# EAGLE design OOBD-Cup_v5 (EAGLE 5.11)
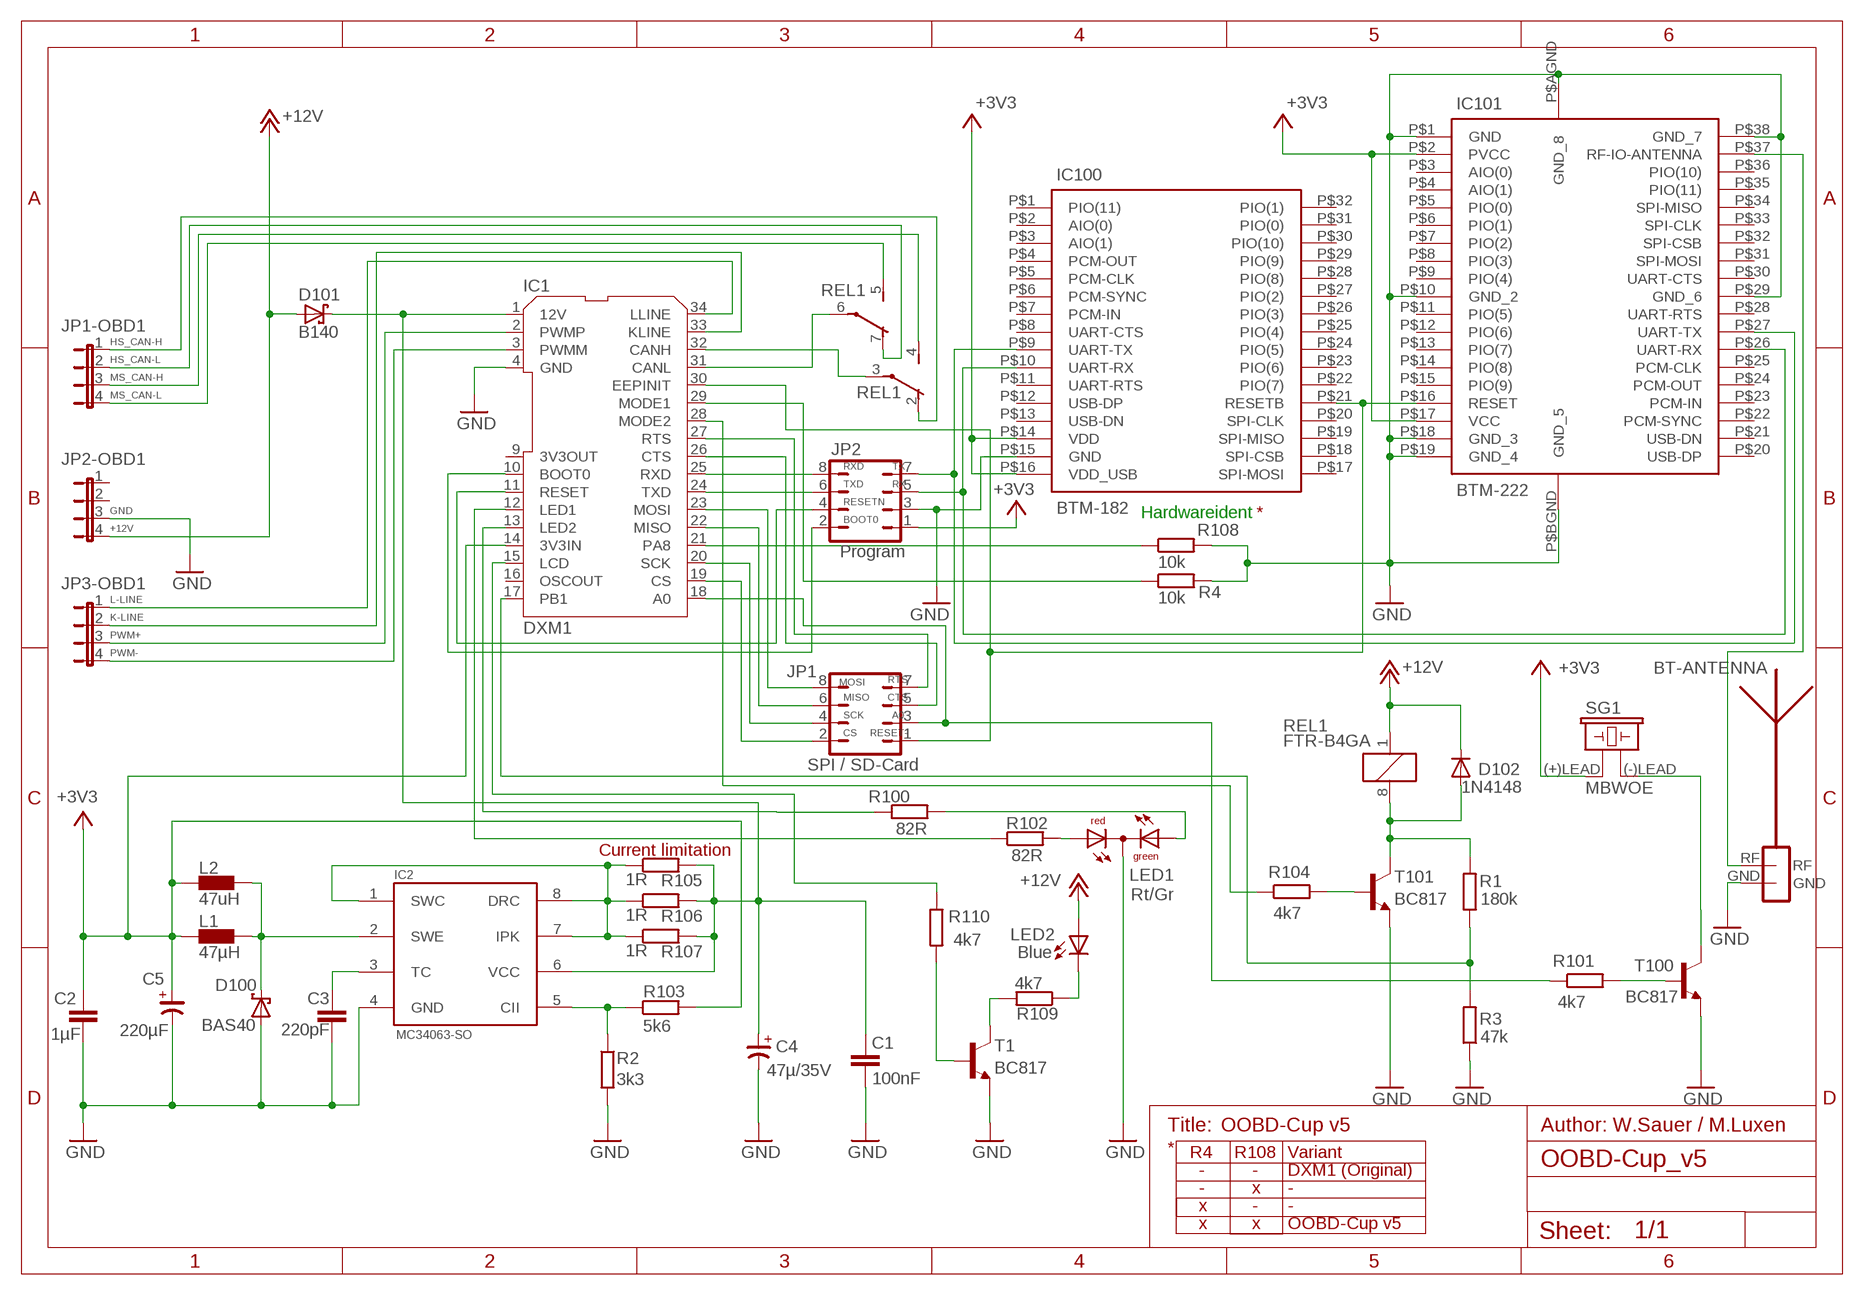
[diagram p0: schematic, sheet 1]

## Parts
BT-ANTENNA  ANTENNA_1RIGHT  [SWRA117D_RIGHT]
C1  100nF  C-EUC0603K  [C0603K]
C2  1µF  C-EUC0603K  [C0603K]
C3  220pF  C-EUC0603K  [C0603K]
C4  47µ/35V  CP-SV-D  [SV-D]
C5  220µF  CP_6032-TE-C  [C6032-TE-C]
D100  BAS40  [SOT23]
D101  B140  SCHOTTKY-DIODESMD  [SMB]
D102  1N4148  DIODE-MINIMELF  [MINIMELF]
IC1  DXM1  DXM1-MINI  [DMX1-MINI]
IC2  MC34063-SO  [SO8]
IC100  BTM-182  [BTM-182]
IC101  BTM-222  [BTM-222]
JP1  SPI / SD-Card  JP4Q  [JP4Q]
JP1-OBD1  JP4E  [JP4]
JP2  Program  JP4Q  [JP4Q]
JP2-OBD1  JP4E  [JP4]
JP3-OBD1  JP4E  [JP4]
L1  47µH  07HCP-XXXX-50  [07HCP-XXXX-50]
L2  47uH  PIS2408  [PIS2408]
LED1  Rt/Gr  DUOLED2X5  [DUOLED2X5]
LED2  Blue  LEDSQR5.7X3.2  [U57X32]
R1  180k  R-EU_R0603  [R0603]
R2  3k3  R-EU_R0603  [R0603]
R3  47k  R-EU_R0603  [R0603]
R4  10k  R-EU_R0603  [R0603]
R100  82R  R-EU_R0603  [R0603]
R101  4k7  R-EU_R0603  [R0603]
R102  82R  R-EU_R0603  [R0603]
R103  5k6  R-EU_R0603  [R0603]
R104  4k7  R-EU_R0603  [R0603]
R105  1R  R-EU_R0805  [R0805]
R106  1R  R-EU_R0805  [R0805]
R107  1R  R-EU_R0805  [R0805]
R108  10k  R-EU_R0603  [R0603]
R109  4k7  R-EU_R0603  [R0603]
R110  4k7  R-EU_R0603  [R0603]
REL1  FTR-B4GA  [FTR-B4GA]
SG1  MBWOE  [BME0603SA]
T1  BC817  BC847  [SOT23]
T100  BC817  BC847  [SOT23]
T101  BC817  BC847  [SOT23]

## Nets
12V_DOUT: C1.1 C4.+ D101.C IC1.1(12V) IC2.6(VCC) R105.2 R106.2 R107.2
+3V3: C2.1 C5.+ IC1.14(3V3IN) IC100.P$14(VDD) IC100.P$16(VDD_USB) IC101.P$2(PVCC) IC101.P$17(VCC) JP2.1 L1.1 L2.P$1 R103.2 SG1.(+)LEAD
+12V: D101.A D102.C JP2-OBD1.4 LED2.A REL1.1
A0: IC1.18(A0) JP1.3 R101.1
BOOT0: IC1.10(BOOT0) JP2.2
CS: IC1.19(CS) JP1.2
CTS: IC1.26(CTS) JP1.5
GND: BT-ANTENNA.GND C1.2 C2.2 C3.2 C4.- C5.- D100.1(A) IC1.4(GND) IC2.4(GND) IC100.P$15(GND) IC101.P$1(GND) IC101.P$10(GND_2) IC101.P$18(GND_3) IC101.P$19(GND_4) IC101.P$29(GND_6) IC101.P$38(GND_7) IC101.P$AGND(GND_8) IC101.P$BGND(GND_5) JP2-OBD1.3 JP2.3 LED1.K(C) R2.2 R3.1 R4.2 R108.2 T1.2(E) T100.2(E) T101.2(E)
HS_CAN-H: JP1-OBD1.1 REL1.2(O)
HS_CAN-L: JP1-OBD1.2 REL1.7(O)
K-LINE: IC1.33(KLINE) JP3-OBD1.2
L-LINE: IC1.34(LLINE) JP3-OBD1.1
LED1: IC1.12(LED1) R102.1
LED2: IC1.13(LED2) R100.1
MISO: IC1.22(MISO) JP1.6
MODE1: IC1.29(MODE1) R4.1
MODE2: IC1.28(MODE2) R104.1
MOSI: IC1.23(MOSI) JP1.8
MS_CAN-H: JP1-OBD1.3 REL1.4(S)
MS_CAN-L: JP1-OBD1.4 REL1.5(S)
N$1: IC2.5(CII) R2.1 R103.1
N$2: C3.1 IC2.3(TC)
N$3: IC1.21(PA8) R108.1
N$4: LED1.AR R102.2
N$5: IC2.1(SWC) IC2.7(IPK) IC2.8(DRC) R105.1 R106.1 R107.1
N$6: LED1.AG R100.2
N$7: LED2.K(C) R109.1
N$8: IC1.15(LCD) R110.1
N$9: R110.2 T1.1(B)
N$10: R109.2 T1.3(C)
N$19: IC1.17(PB1) R1.1 R3.2
N$20: R104.2 T101.1(B)
N$21: IC1.32(CANH) REL1.3(P)
N$22: IC1.31(CANL) REL1.6(P)
N$23: SG1.(-)LEAD T100.3(C)
N$24: R101.2 T100.1(B)
N$27: D102.A R1.2 REL1.8 T101.3(C)
N$29: D100.3(C) IC2.2(SWE) L1.2 L2.P$2
PWM+: IC1.2(PWMP) JP3-OBD1.3
PWM-: IC1.3(PWMM) JP3-OBD1.4
RESET-: IC1.30(EEPINIT) IC100.P$21(RESETB) IC101.P$16(RESET) JP1.1
RESETN: IC1.11(RESET) JP2.4
RF: BT-ANTENNA.RF IC101.P$37(RF-IO-ANTENNA)
RTS: IC1.27(RTS) JP1.7
RX: IC100.P$10(UART-RX) IC101.P$26(UART-RX) JP2.5
RXD: IC1.25(RXD) JP2.8
SCK: IC1.20(SCK) JP1.4
TX: IC100.P$9(UART-TX) IC101.P$27(UART-TX) JP2.7
TXD: IC1.24(TXD) JP2.6
Unconnected: IC1.16(OSCOUT) IC100.P$1(PIO(11)) IC100.P$2(AIO(0)) IC100.P$3(AIO(1)) IC100.P$4(PCM-OUT) IC100.P$5(PCM-CLK) IC100.P$6(PCM-SYNC) IC100.P$7(PCM-IN) IC100.P$8(UART-CTS) IC100.P$11(UART-RTS) IC100.P$12(USB-DP) IC100.P$13(USB-DN) IC100.P$17(SPI-MOSI) IC100.P$18(SPI-CSB) IC100.P$19(SPI-MISO) IC100.P$20(SPI-CLK) IC100.P$22(PIO(7)) IC100.P$23(PIO(6)) IC100.P$24(PIO(5)) IC100.P$25(PIO(4)) IC100.P$26(PIO(3)) IC100.P$27(PIO(2)) IC100.P$28(PIO(8)) IC100.P$29(PIO(9)) IC100.P$30(PIO(10)) IC100.P$31(PIO(0)) IC100.P$32(PIO(1)) IC101.P$3(AIO(0)) IC101.P$4(AIO(1)) IC101.P$5(PIO(0)) IC101.P$6(PIO(1)) IC101.P$7(PIO(2)) IC101.P$8(PIO(3)) IC101.P$9(PIO(4)) IC101.P$11(PIO(5)) IC101.P$12(PIO(6)) IC101.P$13(PIO(7)) IC101.P$14(PIO(8)) IC101.P$15(PIO(9)) IC101.P$20(USB-DP) IC101.P$21(USB-DN) IC101.P$22(PCM-SYNC) IC101.P$23(PCM-IN) IC101.P$24(PCM-OUT) IC101.P$25(PCM-CLK) IC101.P$28(UART-RTS) IC101.P$30(UART-CTS) IC101.P$31(SPI-MOSI) IC101.P$32(SPI-CSB) IC101.P$33(SPI-CLK) IC101.P$34(SPI-MISO) IC101.P$35(PIO(11)) IC101.P$36(PIO(10)) JP2-OBD1.1 JP2-OBD1.2

## Notes on the sheet
- Hardwareident | *
- Current limitation
- Title: | OOBD-Cup v5 | Author: W.Sauer / M.Luxen
- * | R4 | R108 | Variant
- - | - | DXM1 (Original)
- - | x | -
- x | - | -
- x | x | OOBD-Cup v5

## Power pins joined to a net without a drawn wire
3V3OUT: IC1.9(3V3OUT)

## Library data of the parts
BT-ANTENNA = ant-planar-1:ANTENNA_1
C1-C3 = rcl:C-EU: CAPACITOR, European symbol
C4 = cap-master:CP-: POLARIZED CAP
C5 = rc-master:CP_: POLARIZED CAP
D100 = diode:BAS40: Silicon Schottky Diodes General-purpose diode for high-speed switching
D101 = diode:SCHOTTKY-DIODE: Schottky Diode
D102 = diode:DIODE-: DIODE
IC1 = DXM:DXM1-MINI
IC2 = mc34063:MC34063-SO: DC/DC converter MC34063 in SO08.
IC100 = BTM182:BTM-182: Rayson BTM-182 Bluetooth Modul all Pins
IC101 = btm-222:BTM-222: Rayson BTM-222 Bluetooth Modul all Pins
JP1 JP2 = jumper:JP4Q: JUMPER
JP1-OBD1 JP2-OBD1 JP3-OBD1 = jumper:JP4E: JUMPER
L1 = Inductor-Fastron:07HCP-XXXX-50: Fastron 07HCP series (with tube) Plugable inductors (shielded) Source: http://www.fastrongroup.com
L2 = Inductor-Fastron:PIS2408: Fastron SMD Power Inductors Source: http://www.fastrongroup.com/series/47/findProducts
LED1 = led:DUOLED2X5: DUO LED 2 colors, 2.5 x 5 mm, recangle
LED2 = led:LED: LED OSRAM: - CHIPLED LG R971, LG N971, LY N971, LG Q971, LY Q971, LO R971, LY R971 LH N974, LH R974 LS Q976, LO Q976, LY Q976 LO Q996 - Hyper CHIPLED LW Q18S LB Q993, LB Q99A, LB R99A - SideLED LS A670, LO A670, LY A670, LG A670, LP A670 LB A673, LV A673, LT A673, LW A673 LH A674 LY A675 LS A676, LA A676, LO A676, LY A676, LW A676 LS A679, LY A679, LG A679 - Hyper Micro SIDELED® LS Y876, LA Y876, LO Y876, LY Y876 LT Y87S - SmartLED LW L88C, LW L88S LB L89C, LB L89S, LG L890 LS L89K, LO L89K, LY L89K LS L896, LA L896, LO L896, LY L896 - TOPLED LS T670, LO T670, LY T670, LG T670, LP T670 LSG T670, LSP T670, LSY T670, LOP T670, LYG T670 LG T671, LOG T671, LSG T671 LB T673, LV T673, LT T673, LW T673 LH T674 LS T676, LA T676, LO T676, LY T676, LB T676, LH T676, LSB T676, LW T676 LB T67C, LV T67C, LT T67C, LS T67K, LO T67K, LY T67K, LW E67C LS E67B, LA E67B, LO E67B, LY E67B, LB E67C, LV E67C, LT E67C LW T67C LS T679, LY T679, LG T679 LS T770, LO T770, LY T770, LG T770, LP T770 LB T773, LV T773, LT T773, LW T773 LH T774 LS E675, LA E675, LY E675, LS T675 LS T776, LA T776, LO T776, LY T776, LB T776 LHGB T686 LT T68C, LB T68C - Hyper Mini TOPLED® LB M676 - Mini TOPLED Santana® LG M470 LS M47K, LO M47K, LY M47K Source: http://www.osram.convergy.de LUXEON: - LUMILED® LXK2-PW12-R00, LXK2-PW12-S00, LXK2-PW14-U00, LXK2-PW14-V00 LXK2-PM12-R00, LXK2-PM12-S00, LXK2-PM14-U00 LXK2-PE12-Q00, LXK2-PE12-R00, LXK2-PE12-S00, LXK2-PE14-T00, LXK2-PE14-U00 LXK2-PB12-K00, LXK2-PB12-L00, LXK2-PB12-M00, LXK2-PB14-N00, LXK2-PB14-P00, LXK2-PB14-Q00 LXK2-PR12-L00, LXK2-PR12-M00, LXK2-PR14-Q00, LXK2-PR14-R00 LXK2-PD12-Q00, LXK2-PD12-R00, LXK2-PD12-S00 LXK2-PH12-R00, LXK2-PH12-S00 LXK2-PL12-P00, LXK2-PL12-Q00, LXK2-PL12-R00 Source: www.luxeon.com KINGBRIGHT: KA-3528ASYC Source: www.kingbright.com
R1-R4 R100-R110 = rcl:R-EU_: RESISTOR, European symbol
REL1 = relay:FTR-B4: Fujitsu FTR-B4 Series Ultra Miniature 2-Poles 2A (SLIM PROFILE SIGNAL RELAY); MN: Fujitsu; MPN: FTR-B4GAxxxZ; OC_REICHELT: FTR-B4GA 12V
SG1 = buzzer:MBWOE: Buzzer SMD Miniaturbuzzer; MF: Grewus
T1 T100 T101 = transistor:BC847: NPN TRANSISTOR

## Board
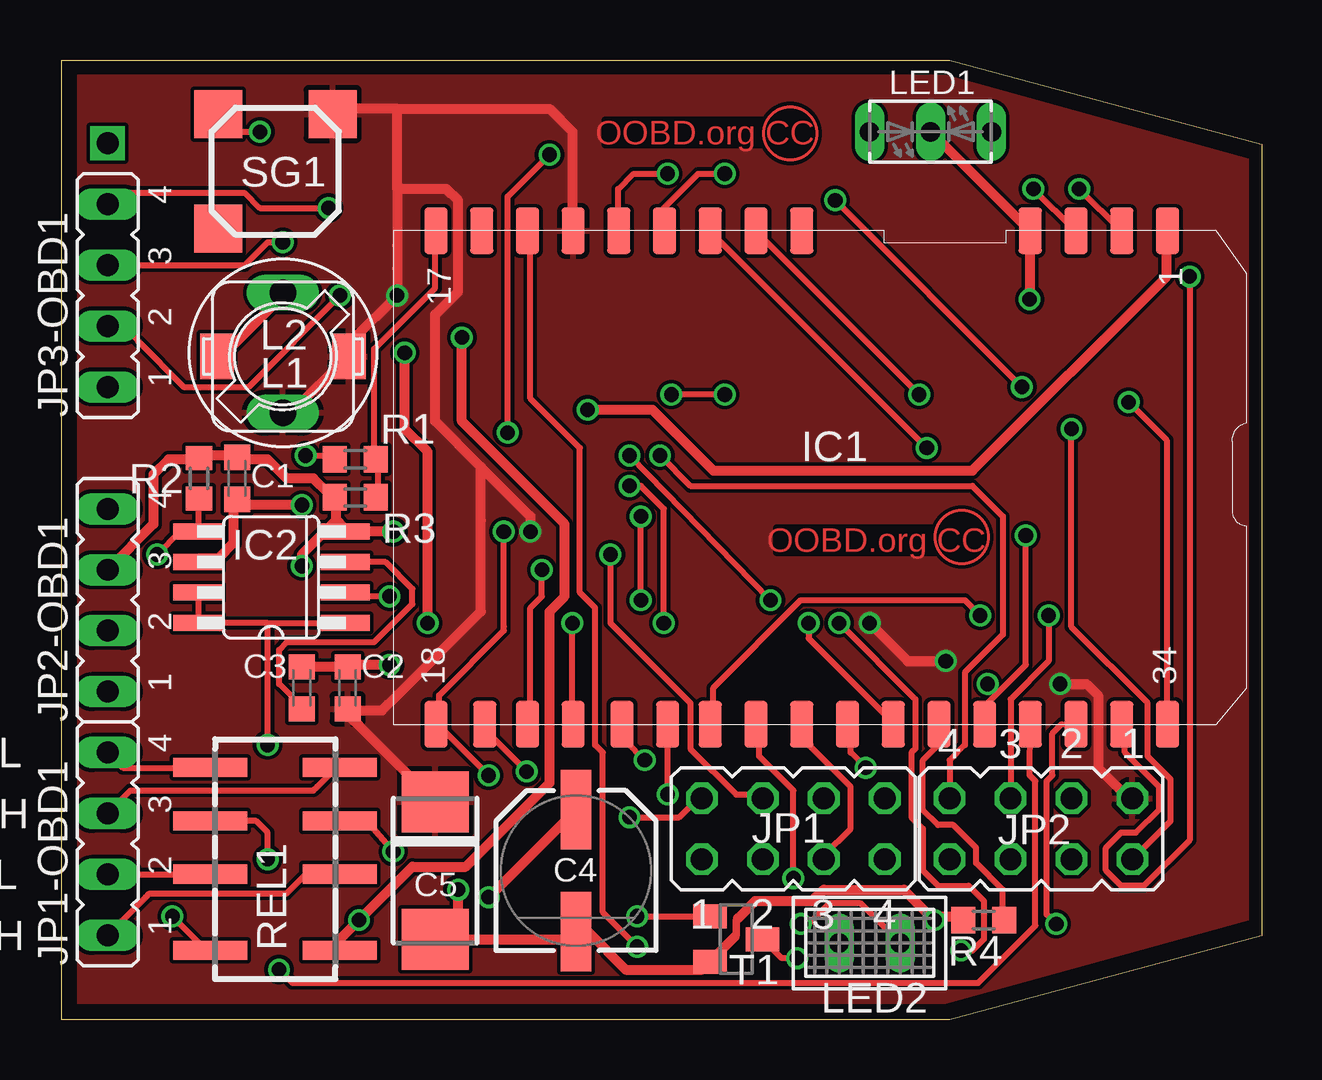
[diagram p1: board, top side]
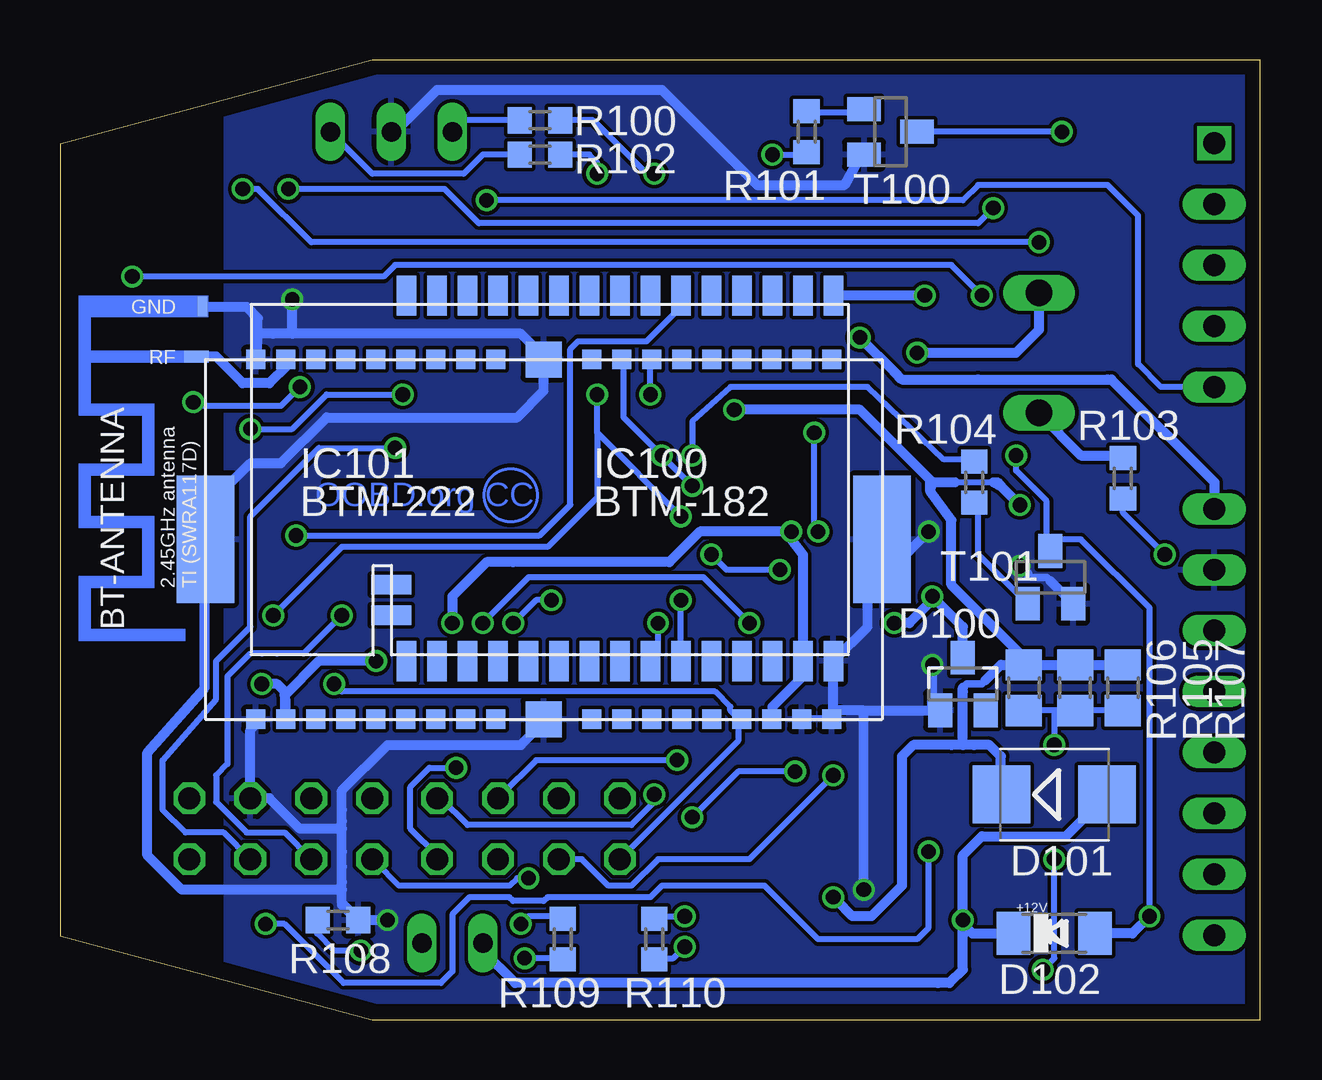
[diagram p2: board, bottom side, seen from below]

Size 50 x 40 mm. Coordinates in mm from the lower left corner, seen from the top.
Outline: 0,0 0,40 37,40 50,36.5 50,3.5 37,0 0,0
Copper layers (1*16): Top 0.035mm / dielectric 1.5mm / Bottom 0.035mm
Design rules "multi-cb_035um-cu *": minimum track width 6mil, minimum drill 12mil, track to track 6mil, track to pad 6mil, pad to pad 6mil, via to via 6mil, smd to smd 6mil, copper to edge 20mil, drill to drill 8mil, minimum pad ring 8mil, minimum via ring 6mil, stop-mask expansion 3mil, vias tented up to drill 0mil, thermal gap 8mil

### Footprints (pad centres in the part's own frame; a part is rotated, then mirrored left to right if it is on the bottom)
SWRA117D_RIGHT = smd 0.813 x 0.406: GND -0.45,0.25 | smd 0.508 x 1.016: RF -2.55,0.5
C0603K = smd 1.05 x 1.08: 1 -0.875,0; 2 0.875,0
SV-D = smd 3.302 x 1.27: + -2.54,0; - 2.54,0
C6032-TE-C = smd 2.54 x 2.794: + 2.857,0; - -2.857,0
SOT23 = smd 1 x 1.4: 1 -0.95,-1.1; 2 0.95,-1.1; 3 0,1.1
SMB = smd 2.4 x 2.4: A 2.2,0; C -2.2,0
MINIMELF = smd 1.4 x 1.8: A 1.7,0; C -1.7,0
DMX1-MINI = smd 1.93 x 0.965: 1 0,32.258; 2 0,30.353; 3 0,28.448; 4 0,26.543; 9 0,17.018; 10 0,15.113; 11 0,13.208; 12 0,11.303; 13 0,9.398; 14 0,7.493; 15 0,5.588; 16 0,3.683; 17 0,1.778; 18 20.574,1.778; 19 20.574,3.81; 20 20.574,5.588; 21 20.574,7.493; 22 20.574,9.525; 23 20.574,11.43; 24 20.574,13.208; 25 20.574,15.113; 26 20.574,17.018; 27 20.574,18.923; 28 20.574,20.828; 29 20.574,22.733; 30 20.574,24.638; 31 20.574,26.543; 32 20.574,28.448; 33 20.574,30.353; 34 20.574,32.258
SO8 = smd 0.66 x 2.032: 1 -1.905,-3.073; 2 -0.635,-3.073; 3 0.635,-3.073; 4 1.905,-3.073; 5 1.905,3.073; 6 0.635,3.073; 7 -0.635,3.073; 8 -1.905,3.073
BTM-182 = smd 1.676 x 0.813: P$1 -7.62,7.62; P$2 -7.62,6.35; P$3 -7.62,5.08; P$4 -7.62,3.81; P$5 -7.62,2.54; P$6 -7.62,1.27; P$7 -7.62,0; P$8 -7.62,-1.27; P$9 -7.62,-2.54; P$10 -7.62,-3.81; P$11 -7.62,-5.08; P$12 -7.62,-6.35; P$13 -7.62,-7.62; P$14 -7.62,-8.89; P$15 -7.62,-10.16; P$16 7.62,-10.16; P$17 7.62,-8.89; P$18 7.62,-7.62; P$19 7.62,-6.35; P$20 7.62,-5.08; P$21 7.62,-3.81; P$22 7.62,-2.54; P$23 7.62,-1.27; P$24 7.62,0; P$25 7.62,1.27; P$26 7.62,2.54; P$27 7.62,3.81; P$28 7.62,5.08; P$29 7.62,6.35; P$30 7.62,7.62 | smd 0.813 x 1.676: P$31 -4.445,8.255; P$32 -5.715,8.255
BTM-222 = smd 0.8 x 0.8: P$1 -12.635,-7.5; P$2 -11.385,-7.5; P$3 -10.135,-7.5; P$4 -8.885,-7.5; P$5 -7.635,-7.5; P$6 -6.385,-7.5; P$7 -5.135,-7.5; P$8 -3.885,-7.5; P$9 -2.635,-7.5; P$11 1.365,-7.5; P$12 2.615,-7.5; P$13 3.865,-7.5; P$14 5.115,-7.5; P$15 6.365,-7.5; P$16 7.615,-7.5; P$17 8.865,-7.5; P$18 10.115,-7.5; P$19 11.365,-7.5; P$20 11.365,7.5; P$21 10.115,7.5; P$22 8.865,7.5; P$23 7.615,7.5; P$24 6.365,7.5; P$25 5.115,7.5; P$26 3.865,7.5; P$27 2.615,7.5; P$28 1.365,7.5; P$30 -2.635,7.5; P$31 -3.885,7.5; P$32 -5.135,7.5; P$33 -6.385,7.5; P$34 -7.635,7.5; P$35 -8.885,7.5; P$36 -10.135,7.5; P$37 -11.385,7.5; P$38 -12.635,7.5 | smd 1.5 x 1.5: P$10 -0.635,-7.5; P$29 -0.635,7.5 | smd 2.4 x 5.3: P$AGND -14.735,0; P$BGND 13.465,0
JP4Q = drill 0.914 octagon: 1 -3.81,-1.27; 2 -3.81,1.27; 3 -1.27,-1.27; 4 -1.27,1.27; 5 1.27,-1.27; 6 1.27,1.27; 7 3.81,-1.27; 8 3.81,1.27
JP4 = drill 0.914 long: 1 -3.81,0; 2 -1.27,0; 3 1.27,0; 4 3.81,0
07HCP-XXXX-50 = drill 1.1 long: 1 -2.5,0; 2 2.5,0
PIS2408 = smd 1.9 x 1.4: P$1 0,2.75; P$2 0,-2.75
DUOLED2X5 = drill 0.813 long: AG -2.54,0; AR 2.54,0; K 0,0
U57X32 = drill 0.813 long: A -1.27,0; K 1.27,0
R0603 = smd 1 x 1.1: 1 -0.85,0; 2 0.85,0
R0805 = smd 1.3 x 1.5: 1 -0.95,0; 2 0.95,0
FTR-B4GA = smd 0.8 x 3.1: 1 -3.8,-3.167; 2 -0.625,-3.167; 3 1.597,-3.167; 4 3.82,-3.167; 5 3.82,2.23; 6 1.597,2.23; 7 -0.625,2.23; 8 -3.8,2.23
BME0603SA = smd 2 x 2: (+)LEAD 4.295,0.425; (-)LEAD -0.475,0.425; NC -0.475,-4.345

### Placement (x,y rotation side)
BT-ANTENNA  43.81,30.18 90 bottom
C1  7.3,22.56 90 top
C2  11.91,13.83 90 top
C3  10,13.83 90 top
C4  21.43,6.21 270 top
C5  15.56,6.21 90 top
D100  12.38,13.99 0 bottom
D101  8.57,9.38 0 bottom
D102  8.57,3.59 0 bottom
IC1  13.81,32.88 270 top
IC2  8.73,18.43 90 top
IC100  27.94,22.56 90 bottom
IC101  29.21,20.02 0 bottom
JP1  30.48,7.96 0 top
JP1-OBD1  1.91,7.32 90 top
JP2  40.8,7.96 180 top
JP2-OBD1  1.91,17.48 90 top
JP3-OBD1  1.91,30.18 90 top
L1  9.21,27.8 90 top
L2  9.21,27.64 270 top
LED1  36.2,37.01 0 top
LED2  33.66,3.19 0 top
R1  12.22,23.35 180 top
R2  5.71,22.56 90 top
R3  12.22,21.77 0 top
R4  38.42,4.15 180 top
R100  30,37.48 180 bottom
R101  18.89,37.01 90 bottom
R102  30,36.05 180 bottom
R103  5.71,22.56 90 bottom
R104  11.91,22.4 270 bottom
R105  7.7,13.83 90 bottom
R106  9.84,13.83 90 bottom
R107  5.71,13.83 90 bottom
R108  38.42,4.15 0 bottom
R109  29.05,3.35 270 bottom
R110  25.24,3.35 90 bottom
REL1  8.41,6.69 90 top
SG1  6.99,37.32 0 top
T1  28.1,3.35 270 top
T100  15.4,37.01 270 bottom
T101  8.73,18.43 0 bottom

### Tracks (layer width: path | path; a pad name or v marks a point on that pad's centre or on a via)
12V_DOUT  (via drill 0.61)
  Top 0.254: C1.1 7.14,21.61 | 5.71,19.23 IC2.6 | 46.04,32.72 IC1.1
  Top 0.406: 7.14,21.61 7.14,19.86 6.51,19.23 5.71,19.23 | 46.04,32.72 46.04,30.97 37.94,22.88 27.15,22.88 24.61,25.42 v21.91,25.42 | v10,21.45 7.46,21.45 C1.1 | v17.78,5.1 C4.+
  Bottom 0.254: R107.2 | 7.62,14.78 R105.2 7.78,14.78 | D101.C 10.79,9.38 | 12.7,22.4 11.11,22.4 | 9.68,14.78 9.53,14.78 R106.2 9.68,14.78
  Bottom 0.305: 12.38,13.83 12.22,13.99 11.59,13.99 11.43,14.15
  Bottom 0.406: 7.62,14.78 R107.2 | 7.78,14.78 9.53,14.78 12.86,18.12 12.86,20.81 13.73,22 | v21.91,25.42 16.67,25.42 14.45,23.19 13.73,22.48 13.73,22 | 10.79,9.38 10.79,9.86 | 10.79,9.86 10.79,10.34 | 10.79,10.34 11.11,10.34 | 12.38,13.83 12.38,13.67 12.38,11.61 12.38,11.45 | 11.43,14.15 10.79,14.78 R106.2 | 10.79,22.24 10.95,22.4 10.79,22.24 | 10.79,22.24 v10,21.45 | 12.7,22.4 13.65,22.4 13.73,22 | 11.11,22.4 10.79,22.24 | v17.78,5.1 17.62,4.94 16.99,4.3 16.19,4.3 14.92,5.57 14.92,10.97 14.45,11.45 12.86,11.45 12.38,11.45 | 12.38,11.45 11.91,11.45 11.27,11.45 10.79,10.97 10.79,10.34 | 10.79,9.86 10.79,10.34
+3V3  (via drill 0.61)
  Top 0.254: 11.59,37.96 11.43,37.8 SG1.(+)LEAD | 21.27,32.88 IC1.14 | L2.P$1 11.91,27.64 | 19.53,20.5 v19.53,20.34
  Top 0.406: 21.27,32.88 21.27,33.99 21.27,37.01 20.32,37.96 19.84,37.96 15.88,37.96 15.4,37.96 13.97,37.96 | 13.97,37.96 11.59,37.96 | L2.P$1 12.06,28.28 v13.97,30.18 13.97,31.29 13.97,32.24 13.97,34.63 | 11.91,27.64 9.53,25.26 9.37,25.26 L1.1 | 13.97,34.63 13.97,37.96 | v41.59,13.99 42.7,13.99 43.18,13.51 43.18,10.49 44.45,9.22 JP2.1 | 12.06,12.56 12.06,12.88 | 12.38,12.24 C5.+ | 12.06,12.56 12.38,12.24 | 12.06,12.88 C2.1 | 12.38,12.24 | 12.06,12.56 12.38,12.24 | 12.06,12.56 11.75,12.88 12.06,12.88 | 12.06,12.88 13.34,12.88 13.97,13.51 17.46,17 17.46,20.81 17.46,23.04 | v36.83,14.94 35.24,14.94 v33.66,16.53 | 13.97,34.63 16.03,34.63 16.51,34.15 16.51,30.34 15.56,29.39 15.56,28.43 15.56,27.8 15.56,24.94 17.46,23.04 | 19.53,20.5 19.53,20.97 17.46,23.04
  Bottom 0.254: 17.62,30.18 IC100.P$16 | 20.32,12.56 IC101.P$17 | IC101.P$2 40.64,12.56
  Bottom 0.406: R103.2 5.87,23.51 7.46,23.51 9.21,25.26 L1.1 | v13.97,30.18 17.62,30.18 | 40.64,13.67 40.96,13.99 v41.59,13.99 | 40.64,13.67 IC101.P$2 | 20.32,12.56 20.32,13.04 19.05,14.3 IC100.P$14 18.89,15.1 19.05,15.26 19.05,16.69 19.05,19.38 19.53,20.02 v19.53,20.34 23.34,20.34 24.61,19.07 31.11,19.07 32.23,19.07 33.66,17.64 v33.66,16.53 | 40.64,13.67 40.64,13.51 39.21,14.94 v36.83,14.94 | 40.64,13.67 40.64,12.56
  pour Top: 0.64,39.39 36.83,39.39 49.45,35.89 49.45,4.15 36.83,0.65 0.64,0.65
+12V  (via drill 0.61)
  Top 0.254: 11.59,3.03 REL1.1
  Top 0.406: v16.67,28.43 16.67,24.94 20.95,20.65 20.95,17.64 20.32,17 20.32,9.86 16.83,6.37 14.61,6.37 12.3,4.07 | 12.3,4.07 12.22,3.99 11.59,3.35 11.59,3.03 | v12.38,4.15 12.54,4.15 12.3,4.07
  Bottom 0.254: 6.51,9.22 D101.A
  Bottom 0.406: 6.51,9.22 8.1,7.64 11.59,7.64 12.38,6.84 v12.38,4.15 12.38,3.99 | LED2.A 32.38,2.87 31.04,1.53 13.41,1.53 12.94,1.53 12.38,2.08 12.38,3.99 | v16.67,28.43 15.24,27.01 14.92,26.69 11.75,26.69 6.35,26.69 6.19,26.69 1.91,22.4 JP2-OBD1.4 | 12.38,3.99 11.99,3.59 D102.C | 12.38,3.99 12.38,3.51 12.38,3.99
A0  (via drill 0.61)
  Top 0.254: v20.32,36.05 18.57,34.31 18.57,33.99 v18.57,24.47 | v18.41,20.34 18.41,16.37 18.41,16.21 15.72,13.51 15.72,12.4 IC1.18 15.72,12.24 v17.78,10.18
  Bottom 0.254: v20.32,36.05 18.73,36.05 R101.1 | v18.57,24.47 18.57,20.5 v18.41,20.34 | v17.78,10.18 21.27,6.69 25.08,6.69 26.19,5.57 27.15,5.57 28.26,6.69 29.05,6.69 JP1.3
BOOT0  (via drill 0.61)
  Top 0.254: v35.72,26.05 29.05,32.72 IC1.10 | v42.07,24.62 42.07,16.37 45.24,13.19 45.24,10.97 46.2,10.02 46.2,8.27 JP2.2
  Bottom 0.254: v35.72,26.05 38.89,26.05 40.32,24.62 41.91,24.62 v42.07,24.62
CS  (via drill 0.61)
  Top 0.254: v19.37,10.34 17.78,11.92 17.78,12.24 IC1.19 | v23.65,8.43 25.72,8.43 26.51,9.22 JP1.2
  Bottom 0.254: v19.37,10.34 21.75,10.34 v23.65,8.43
CTS
  Top 0.254: IC1.26 30.96,12.24 30.96,11.61 32.86,9.7 32.86,7.96 31.75,6.84 JP1.5
GND  (via drill 0.6, 0.61)
  Top 0.254: IC1.4 40.32,32.88 | 7.14,23.51 C1.2 7.3,23.35 | 5.71,23.51 R2.2 5.56,23.35 | 11.43,21.77 R3.1 | 11.75,20.5 IC2.4 11.91,20.34 | 11.91,14.78 C2.2 12.06,14.78 | 15.72,3.35 C5.- 15.72,3.35 | 28.1,4.15 28.18,4.22 | 27.15,2.56 T1.2 26.99,2.4 | v36.35,4.15 36.35,4.3 | 15.72,3.35 16.51,3.35
  Top 0.305: 28.1,4.15 28.1,3.51 28.02,3.43
  Top 0.406: 40.32,32.88 LED1.K | 7.14,23.51 5.71,23.51 | 5.56,23.35 4.45,23.35 3.81,22.72 3.81,20.65 JP2-OBD1.3 | 11.43,20.81 11.43,21.77 | 11.75,20.5 11.43,20.81 | v10,18.91 10,19.38 11.43,20.81 | 7.3,23.35 8.57,23.35 9.37,22.56 10.48,22.56 11.11,21.92 R3.1 | v13.65,14.78 12.06,14.78 | v13.81,20.34 11.91,20.34 | 16.51,3.35 21.11,3.35 C4.- 21.59,3.67 21.91,3.67 23.5,2.08 26.67,2.08 26.99,2.4 | 15.72,3.35 16.51,3.35 | 28.18,4.22 28.89,4.94 29.21,4.94 31.27,4.94 31.75,5.41 35.08,5.41 v36.35,4.15 36.35,4.3 37.47,4.3 R4.2 | 27.15,2.56 27.46,2.87 27.54,2.95 27.7,3.11 28.02,3.43 | 16.51,3.35 v16.51,5.41 | C2.2 C3.2 | v40.32,30.02 40.35,30.02 IC1.4
  Bottom 0.254: IC101.P$38 41.91,27.48 | 43.81,20.18 IC101.P$AGND 43.97,20.02 | IC101.P$29 29.84,27.64 | 16.51,36.21 T100.2 | LED1.K 36.04,37.01 | 7.94,17.48 T101.2 | IC101.P$19 17.94,12.56 19.05,12.56 IC101.P$18 | IC101.P$19 17.78,12.56 17.78,12.88 IC101.P$19 | 29.84,12.4 IC101.P$10 | 37.47,4.15 37.54,4.15 R4.2 | 44.05,29.7 BT-ANTENNA.GND | 13.65,12.88 D100.1 13.65,12.88 | 15.88,18.27 15.88,20.02 IC101.P$BGND 15.88,18.27
  Bottom 0.305: 8.73,18.27 8.89,18.43 9.53,18.43 9.68,18.59
  Bottom 0.406: 29.84,27.64 30.48,28.28 30.8,28.59 40.32,28.59 | 40.32,28.59 41.12,28.59 41.75,28.59 | 41.75,28.59 IC101.P$38 | 16.51,36.21 17.3,34.78 20.64,34.78 20.95,34.78 24.92,38.75 34.29,38.75 36.04,37.01 | 40.32,28.59 v40.32,30.02 | 8.73,18.27 7.94,17.48 | v10,18.91 9.68,18.59 | 16.51,12.88 17.78,12.88 IC100.P$15 16.35,16.37 16.35,17.64 15.88,18.27 v13.81,20.34 | 16.51,12.88 13.65,12.88 v13.65,14.78 | 41.27,9.22 JP2.3 | 41.27,9.22 JP2.3 | JP2.3 42.07,12.08 41.91,12.24 41.91,12.4 IC101.P$1 | 38.26,5.41 38.26,5.73 38.26,6.37 38.26,7 38.26,7.96 | 41.27,9.22 40.01,7.96 39.37,7.96 38.26,7.96 | 29.84,12.4 30.8,11.45 36.35,11.45 38.26,9.54 38.26,8.75 38.26,8.27 | v36.35,4.15 37.47,4.15 | v16.51,5.41 16.51,12.88 | 43.97,20.02 43.97,13.83 46.35,11.13 46.35,6.84 44.93,5.41 38.26,5.41 | 41.75,28.59 41.75,29.23 42.23,29.7 44.05,29.7 | 43.81,20.18 43.81,21.45 42.07,23.19 40.8,23.19 38.89,25.1 30.96,25.1 29.84,26.21 IC101.P$29 | 38.26,7.96 38.26,8.27 | 38.26,7.96 38.26,8.27 | 38.26,5.41 38.26,4.86 38.18,4.78 | 37.54,4.15 38.18,4.78 | 37.54,4.15 37.62,4.15 38.26,4.78 38.18,4.78 | 37.54,4.15 38.18,4.78
  pour Bottom: 0.64,39.39 36.83,39.39 43.18,37.64 43.18,2.4 36.83,0.65 0.64,0.65
HS_CAN-H
  Top 0.254: JP1-OBD1.1 3.49,5.1 3.65,5.26 9.37,5.26 10.16,6.05 11.43,6.05 REL1.2
HS_CAN-L
  Top 0.254: JP1-OBD1.2 2.7,6.05 5.87,6.05 6.03,6.21 REL1.7
K-LINE  (via drill 0.61)
  Top 0.254: v46.99,30.97 46.99,7.48 45.09,5.57 44.13,5.57 43.5,6.21 43.5,7.16 44.13,7.8 44.77,7.8 45.72,8.75 45.72,9.7 44.29,11.13 44.29,12.24 IC1.33 | v11.59,30.18 7.78,26.37 5.08,26.37 3.17,28.28 2.54,28.91 JP3-OBD1.2
  Bottom 0.254: v46.99,30.97 36.51,30.97 36.04,31.45 12.86,31.45 v11.59,30.18
L-LINE  (via drill 0.61)
  Top 0.254: v44.45,25.74 46.04,24.15 46.04,12.4 IC1.34 | v32.23,34.15 v40.01,26.37
  Bottom 0.254: v40.01,26.37 40.8,25.58 41.43,25.58 44.29,25.58 v44.45,25.74 | v32.23,34.15 12.38,34.15 11.75,34.78 6.35,34.78 5.08,33.51 5.08,27.32 4.13,26.37 JP3-OBD1.1
LED1  (via drill 0.61)
  Top 0.254: v27.62,35.26 26.83,35.26 26.51,35.26 25.08,33.83 25.08,32.88 IC1.12
  Bottom 0.254: v27.62,35.26 27.62,35.74 27.94,36.05 29.05,36.05 R102.1
LED2  (via drill 0.61)
  Top 0.254: v25.24,35.26 23.81,35.26 23.18,34.63 23.18,32.88 IC1.13
  Bottom 0.254: v25.24,35.26 25.56,35.26 | 25.56,35.26 | 25.56,35.26 27.78,37.48 28.89,37.48 R100.1
MISO  (via drill 0.61)
  Top 0.254: v24.29,10.81 23.5,11.61 23.5,12.24 IC1.22
  Bottom 0.254: v24.29,10.81 30.16,10.81 31.59,9.38 JP1.6
MODE1
  Top 0.254: R4.1 39.21,4.3 39.21,5.41 38.1,6.53 38.1,7.16 37.15,8.11 36.51,8.11 35.88,8.75 35.88,10.81 36.51,11.45 36.51,12.24 IC1.29
MODE2  (via drill 0.61)
  Top 0.254: v23.65,23.51 v29.53,17.48 | v31.11,16.53 31.11,15.89 34.61,12.4 IC1.28
  Bottom 0.254: v23.65,23.51 23.65,24.94 22.07,26.37 16.35,26.37 13.18,23.35 11.91,23.35 R104.1 | v29.53,17.48 30.16,17.48 v31.11,16.53
MOSI  (via drill 0.61)
  Top 0.254: v25.24,9.38 25.24,12.24 IC1.23
  Bottom 0.254: v25.24,9.38 25.24,9.07 26.19,8.11 33.02,8.11 34.13,9.22 JP1.8
MS_CAN-H
  Top 0.254: JP1-OBD1.3 2.86,9.54 10.48,9.54 10.64,9.7 11.43,10.49 REL1.4
MS_CAN-L
  Top 0.254: JP1-OBD1.4 2.54,10.49 5.4,10.5 REL1.5
N$1  (via drill 0.61)
  Top 0.254: 5.71,20.34 5.71,20.5 | 5.71,20.34 5.71,20.5 | 5.71,20.5 5.71,21.61 R2.1 | 5.71,20.5 IC2.5 | v3.97,19.38 4.92,20.34 5.4,20.34 5.71,20.34
  Bottom 0.254: v3.97,19.38 4.13,19.54 5.71,21.13 R2.1 | R2.1 5.71,21.77 R2.1
N$2
  Top 0.254: C3.1 10,13.04 9.05,13.99 9.05,15.42 9.37,15.73 13.02,15.73 14.61,17.32 14.61,17.96 13.49,19.07 11.91,19.07 IC2.3
N$3  (via drill 0.61)
  Top 0.254: v37.47,2.87 37.94,2.87 38.42,3.35 38.42,4.94 37.78,5.57 36.51,5.57 35.88,6.21 35.88,7.96 35.4,8.43 35.4,11.13 35.56,11.29 35.56,13.35 v32.38,16.53 | v21.27,16.53 21.27,12.4 IC1.21
  Bottom 0.254: v37.47,2.87 38.58,2.87 39.29,3.59 R108.1 | v32.38,16.53 30.48,18.43 23.18,18.43 v21.27,16.53
N$4
  Bottom 0.254: R102.2 30.96,36.05 32.38,36.05 33.18,35.26 36.99,35.26 38.58,36.85 LED1.AR
N$5  (via drill 0.61)
  Top 0.254: IC2.7 5.71,17.8 5.71,16.69 IC2.8 5.71,16.53 8.57,16.53 | 8.57,16.53 11.75,16.53 IC2.1 | v8.57,11.45 8.57,16.53
  Bottom 0.254: R107.1 7.62,12.88 R105.1 7.78,12.88 8.57,12.88 | 8.57,12.88 9.68,12.88 R106.1 | 8.57,12.88 v8.57,11.45
N$6
  Bottom 0.254: LED1.AG 33.5,37.17 33.18,37.48 R100.2
N$7  (via drill 0.61)
  Top 0.254: LED2.K 33.26,4.86 31.99,4.86 31.11,3.99 v30.8,3.99
  Bottom 0.254: 29.05,4.3 R109.1 29.13,4.3 30.32,4.3 30.48,4.3 v30.8,3.99
N$8  (via drill 0.61)
  Top 0.254: v23.97,3.03 22.54,4.46 22.54,11.13 22.23,11.45 22.23,17.16 21.59,17.8 21.59,23.83 19.53,25.89 19.53,32.72 IC1.15
  Bottom 0.254: v23.97,3.03 24.45,2.56 25.24,2.56 R110.1
N$9  (via drill 0.61)
  Top 0.254: v23.97,4.3 26.99,4.3 T1.1
  Bottom 0.254: v23.97,4.3 25.08,4.3 R110.2
N$10  (via drill 0.61)
  Top 0.254: v30.64,2.56 30,2.56 T1.3
  Bottom 0.254: v30.64,2.56 29.05,2.56 R109.2
N$14  (via drill 0.91 pad 1.42)
  other vias: 1.91,36.53
N$19
  Top 0.254: R3.2 13.18,21.92 13.18,23.35 R1.1 13.02,23.51 13.02,27.96 15.56,30.5 15.56,32.72 IC1.17
N$20
  Bottom 0.254: R104.2 11.75,21.45 11.75,19.38 T101.1
N$21  (via drill 0.61)
  Top 0.254: IC1.32 41.67,12.32 41.27,11.92 41.27,10.18 41.04,9.94 41.04,4.38 v41.43,3.99 | REL1.3 12.7,8.27 v13.81,7
  Bottom 0.254: v13.81,7 13.81,3.83 14.29,3.35 18.41,3.35 19.53,4.46 20.64,5.57 24.92,5.57 25.4,5.1 25.64,5.1 26.19,5.1 29.69,5.1 29.84,4.94 31.11,4.94 31.27,5.1 32.94,5.1 33.66,4.38 33.66,2 34.13,1.53 38.18,1.53 40.64,3.99 v41.43,3.99
N$22  (via drill 0.61)
  Top 0.254: IC1.31 40.32,10.18 40.56,9.94 40.56,3.91 39.21,2.56 38.42,1.76 38.18,1.53 38.1,1.53 37.86,1.53 9.6,1.53 v9.05,2.08 | REL1.6 8.1,8.27 8.57,7.8 v8.57,6.69
  Bottom 0.254: v8.57,6.69 8.57,2.56 v9.05,2.08
N$23  (via drill 0.61)
  Top 0.254: v8.26,37.01 7.3,37.01 6.67,37.64 SG1.(-)LEAD
  Bottom 0.254: v8.26,37.01 14.29,37.01 T100.3
N$24
  Bottom 0.254: R101.2 18.73,37.8 16.51,37.8 T100.1
N$27  (via drill 0.61)
  Top 0.254: v10.16,23.51 11.27,23.51 R1.2 | v4.6,4.3 6.03,2.87 REL1.8
  Bottom 0.254: v10.16,23.51 10.16,22.88 8.89,21.61 8.89,20.02 | 8.89,20.02 8.89,19.54 T101.3 8.89,20.02 | 8.89,20.02 7.46,20.02 4.6,17.16 v4.6,4.3
  Bottom 0.406: D102.A 5.32,3.59 v4.6,4.3
N$29  (via drill 0.61)
  Top 0.254: v13.65,17.64 12.06,17.64 11.91,17.8 IC2.2 | 6.51,27.8 L2.P$2 | L1.2 9.21,30.18
  Top 0.406: 6.51,27.8 6.83,27.8 9.21,30.18 | v15.24,16.53 15.24,23.67 14.29,24.62 v14.29,27.8
  Bottom 0.254: D100.3 | v13.65,17.64 13.65,17.48
  Bottom 0.406: D100.3 12.38,16.37 v13.65,17.64 | 13.65,17.48 14.61,16.53 v15.24,16.53 | v14.29,27.8 10.16,27.8 9.21,28.75 L1.2 9.21,30.34
PWM+  (via drill 0.61)
  Top 0.254: v42.39,34.63 44.13,32.88 IC1.2 | v9.21,32.4 8.57,32.4 7.62,31.45 3.02,31.45 JP3-OBD1.3
  Bottom 0.254: v42.39,34.63 41.75,34.63 39.53,32.4 v9.21,32.4
PWM-  (via drill 0.61)
  Top 0.254: v40.48,34.63 42.23,32.88 IC1.3 | v11.11,33.83 8.26,33.83 7.62,34.47 2.38,34.47 JP3-OBD1.4
  Bottom 0.254: v40.48,34.63 33.97,34.63 32.54,33.2 11.75,33.2 v11.11,33.83
RESET-  (via drill 0.61)
  Top 0.254: v40.16,20.18 40.16,14.78 39.69,14.3 38.97,13.59 | 38.97,13.59 38.58,13.19 38.58,12.4 IC1.30 | v38.58,13.99 38.89,13.67 38.97,13.59
  Bottom 0.254: JP1.1 26.51,6.84 21.75,11.61 21.75,12.4 IC101.P$16 21.75,12.56 22.07,12.88 22.07,13.04 22.7,13.67 38.26,13.67 v38.58,13.99 | IC100.P$21 24.13,29.7 25.56,28.28 28.42,28.28 28.73,27.96 28.73,21.45 30,20.18 v40.16,20.18
RESETN  (via drill 0.61)
  Top 0.254: v36.04,23.83 27.15,32.72 IC1.11
  Bottom 0.254: v36.04,23.83 39.21,23.83 42.07,20.97 42.07,16.37 43.5,14.94 43.5,13.35 45.72,10.81 45.72,8.75 44.77,7.8 43.18,7.8 JP2.4
RF
  Bottom 0.254: IC101.P$37 40.56,27.24 | 44.29,27.64 BT-ANTENNA.RF
  Bottom 0.406: 40.56,27.24 41.27,26.53 42.39,26.53 43.5,27.64 44.29,27.64
RTS  (via drill 0.61)
  Top 0.254: v33.5,10.49 32.86,11.13 32.86,12.24 IC1.27
  Bottom 0.254: v33.5,10.49 34.61,10.49 35.4,9.7 35.4,7.96 34.29,6.84 JP1.7
RX  (via drill 0.61)
  Top 0.254: v27.62,26.05 v25.4,26.05 | v41.12,16.85 41.12,14.94 39.53,13.35 JP2.5 | v24.13,17.48 v24.13,20.97
  Bottom 0.254: v25.4,26.05 25.4,27.48 IC101.P$26 | 27.62,24.47 v27.62,26.05 27.62,24.47 | 27.62,24.47 27.62,21.77 29.69,19.7 38.26,19.7 v41.12,16.85 | v24.13,17.48 24.13,15.1 IC100.P$10 | v24.13,20.97 27.62,24.47
RXD  (via drill 0.61)
  Top 0.254: v30.48,5.89 30.48,9.54 29.05,10.97 29.05,12.24 IC1.25
  Bottom 0.254: v30.48,5.89 30.96,5.89 31.27,5.57 35.88,5.57 36.83,6.53 JP2.8
SCK  (via drill 0.61)
  Top 0.254: v20,18.75 20,17.64 19.53,17.16 19.53,12.4 IC1.20 | v22.86,19.38 22.86,16.53 26.19,13.19 26.19,11.29 28.1,9.38 29.05,9.38 JP1.4
  Bottom 0.254: v20,18.75 22.23,18.75 v22.86,19.38
TX  (via drill 0.61)
  Top 0.254: v23.65,22.24 24.13,22.24 25.08,21.29 v25.08,16.53 | JP2.7 36.99,10.81 37.62,11.45 37.62,14.46 39.21,16.05 39.21,20.97 37.94,22.24 26.19,22.24 v24.92,23.51
  Bottom 0.254: v23.65,22.24 24.84,23.43 | 24.84,23.43 v24.92,23.51 | v24.92,23.51 26.51,25.1 26.51,27.48 IC101.P$27 | v25.08,16.53 25.08,15.26 25.24,15.1 IC100.P$9 | v24.92,23.51 24.84,23.43
TXD  (via drill 0.61)
  Top 0.254: v38.26,16.85 37.62,17.48 30.8,17.48 27.15,13.83 27.15,12.4 IC1.24
  Bottom 0.254: v38.26,16.85 39.85,15.26 40.96,15.26 41.59,15.26 42.07,15.26 43.02,14.3 43.02,10.65 43.5,10.18 43.5,9.07 42.23,7.8 40.64,7.8 JP2.6
(copper drawn outside any net)
  shapes: Bottom circle x1, Top circle x2

### Text on the board
Top: OOBD.org CC | OOBD.org CC
Bottom: OOBD.org CC
tNames: PWM- | PWM+ | K-Line | L-Line | +12V | GND | NC | NC | MS-CAN-L | MS-CAN-H | HS-CAN-L | HS-CAN-H
bNames: +12V